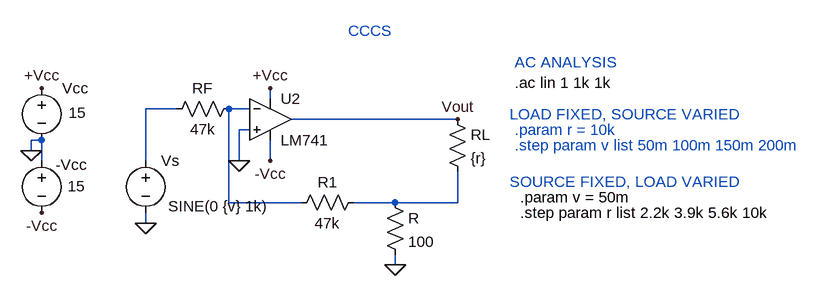
[diagram p0: schematic CCCS.asc]
CCCS.asc, the LTspice schematic file:
Version 4
SHEET 1 1220 680
WIRE 352 112 352 96
WIRE 208 128 160 128
WIRE 320 128 288 128
WIRE 640 144 384 144
WIRE 320 160 304 160
WIRE 0 176 -16 176
WIRE -16 192 -16 176
WIRE 0 208 0 176
WIRE 160 208 160 128
WIRE 304 208 304 160
WIRE 352 208 352 176
WIRE 288 272 288 128
WIRE 400 272 288 272
WIRE 544 272 480 272
WIRE 640 272 640 224
WIRE 640 272 544 272
WIRE 160 304 160 288
WIRE 544 368 544 352
FLAG -16 192 0
FLAG 0 96 +Vcc
FLAG 0 288 -Vcc
FLAG 352 96 +Vcc
FLAG 352 208 -Vcc
FLAG 160 304 0
FLAG 640 144 Vout
FLAG 304 208 0
FLAG 544 368 0
SYMBOL voltage 160 192 R0
WINDOW 3 35 86 Left 2
WINDOW 39 0 0 Left 2
SYMATTR Value SINE(0 {v} 1k)
SYMATTR InstName Vs
SYMATTR Value2 AC {v} 0
SYMBOL voltage 0 80 R0
WINDOW 0 32 16 Left 2
WINDOW 3 42 54 Left 2
WINDOW 123 0 0 Left 2
WINDOW 39 135 -14 Left 2
SYMATTR InstName Vcc
SYMATTR Value 15
SYMBOL voltage 0 192 R0
WINDOW 0 22 22 Left 2
WINDOW 3 40 55 Left 2
WINDOW 123 0 0 Left 2
WINDOW 39 131 -86 Left 2
SYMATTR InstName -Vcc
SYMATTR Value 15
SYMBOL Opamps\\LM741 352 80 R0
SYMATTR InstName U2
SYMBOL res 624 128 R0
SYMATTR InstName RL
SYMATTR Value {r}
SYMBOL res 304 112 R90
WINDOW 0 0 56 VBottom 2
WINDOW 3 32 56 VTop 2
SYMATTR InstName RF
SYMATTR Value 47k
SYMBOL res 528 256 R0
SYMATTR InstName R
SYMATTR Value 100
SYMBOL res 496 256 R90
WINDOW 0 0 56 VBottom 2
WINDOW 3 32 56 VTop 2
SYMATTR InstName R1
SYMATTR Value 47k
TEXT 728 88 Left 2 !.ac lin 1 1k 1k
TEXT 736 264 Left 2 !.param v = 50m
TEXT 728 160 Left 2 ;.param r = 10k
TEXT 736 288 Left 2 !.step param r list 2.2k 3.9k 5.6k 10k
TEXT 728 184 Left 2 ;.step param v list 50m 100m 150m 200m
TEXT 472 8 Left 2 ;CCCS
TEXT 728 56 Left 2 ;AC ANALYSIS
TEXT 720 240 Left 2 ;SOURCE FIXED, LOAD VARIED
TEXT 720 136 Left 2 ;LOAD FIXED, SOURCE VARIED

The netlist it stands for:
* CCCS.asc
Vs N001 0 SINE(0 {v} 1k) AC {v} 0
Vcc +Vcc 0 15
V§-Vcc 0 -Vcc 15
XU2 0 N002 +Vcc -Vcc Vout LM741  ; pins In+ In- V+ V- OUT
RL Vout N003 {r}
RF N002 N001 47k
R N003 0 100
R1 N003 N002 47k
.ac lin 1 1k 1k
.param v = 50m
* .param r = 10k
.step param r list 2.2k 3.9k 5.6k 10k
* .step param v list 50m 100m 150m 200m
* CCCS
* AC ANALYSIS
* SOURCE FIXED, LOAD VARIED
* LOAD FIXED, SOURCE VARIED
.lib LM741.lib
.backanno
.end